# Altium schematic sheet led2.SchDoc
size A4; DocumentNumber: 2; SheetNumber: 2; SheetTotal: 8
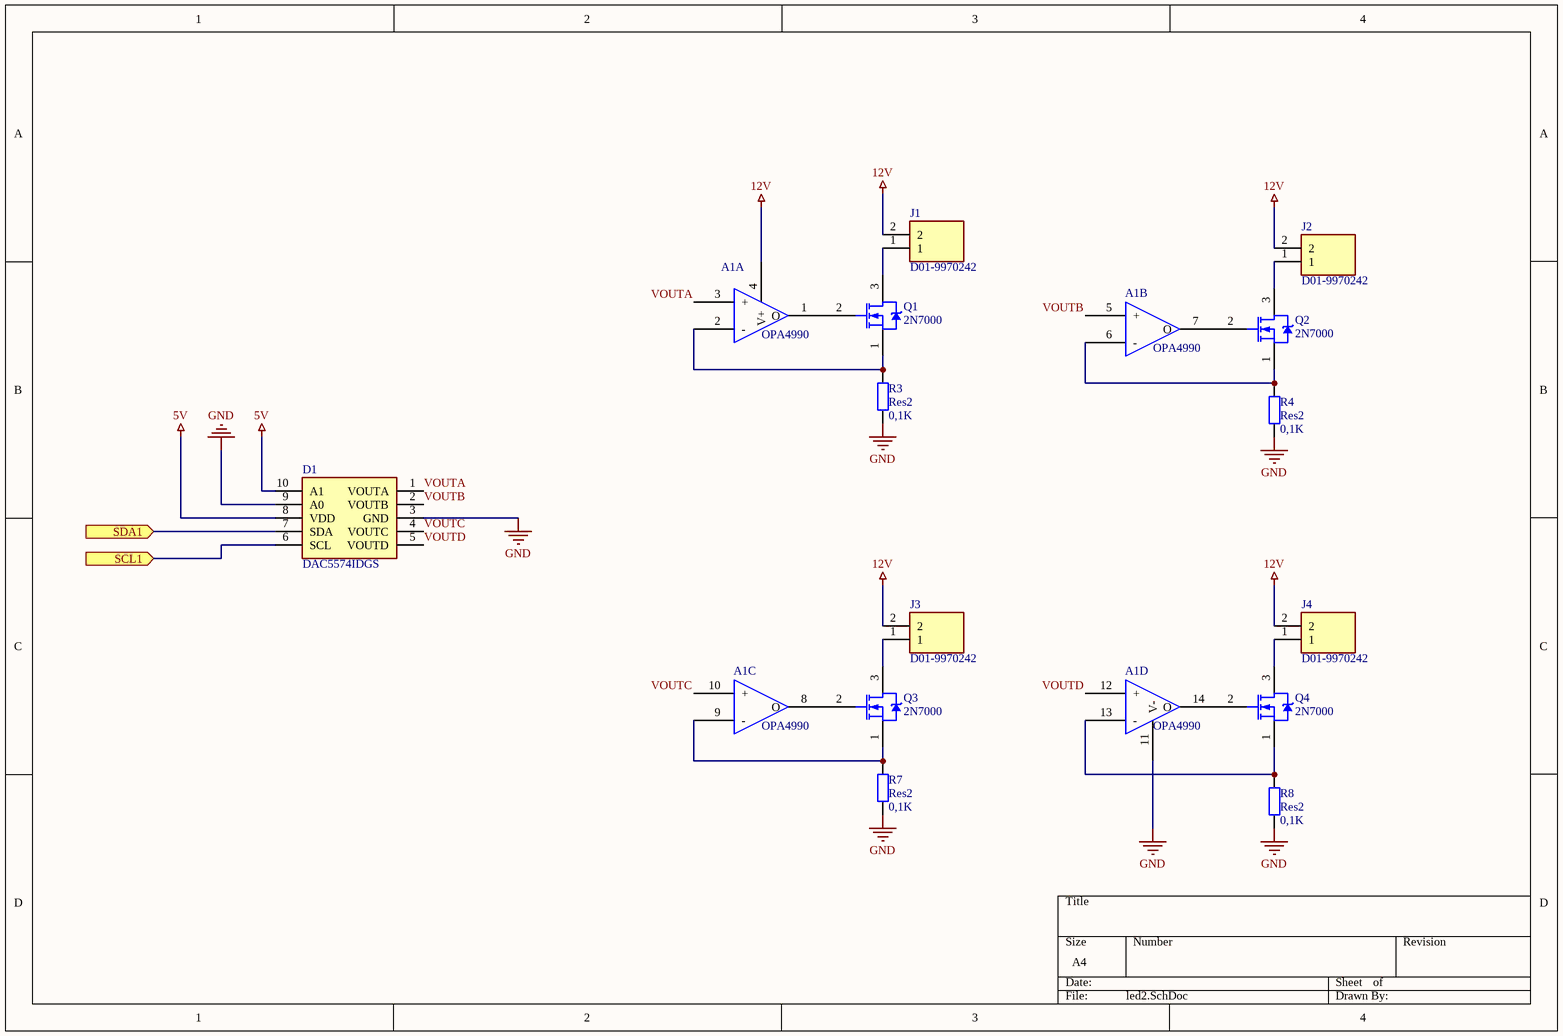
[diagram p0: led2.SchDoc]

## Parts
A1  OPA4990  [SOIC127P600X175-14N]  (parts A,B,C,D of 4)
D1  DAC5574IDGS  [SOP50P490X110-10N]
J1  D01-9970242  [HDR1X2]
J2  D01-9970242  [HDR1X2]
J3  D01-9970242  [HDR1X2]
J4  D01-9970242  [HDR1X2]
Q1  2N7000  [ONSC-TO-92-3-29-11]
Q2  2N7000  [ONSC-TO-92-3-29-11]
Q3  2N7000  [ONSC-TO-92-3-29-11]
Q4  2N7000  [ONSC-TO-92-3-29-11]
R3  Res2  value 0,1K  [C1210]
R4  Res2  value 0,1K  [C1210]
R7  Res2  value 0,1K  [C1210]
R8  Res2  value 0,1K  [C1210]

## Ports
SCL1 (in), SDA1 (in)

## Nets
5V: D1.8(VDD) D1.10(A1)
12V: A1.4(V+) J1.2 J2.2 J3.2 J4.2
GND: A1.11(V-) D1.3(GND) D1.9(A0) R3.1 R4.1 R7.1 R8.1
SCL1: D1.6(SCL) ; port SCL1
SDA1: D1.7(SDA) ; port SDA1
VOUTA: A1.3(+) D1.1(VOUTA)
VOUTB: A1.5(+) D1.2(VOUTB)
VOUTC: A1.10(+) D1.4(VOUTC)
VOUTD: A1.12(+) D1.5(VOUTD)
NetA1_1: A1.1(O) Q1.2(G)
NetA1_2: A1.2(-) Q1.1(S) R3.2
NetA1_6: A1.6(-) Q2.1(S) R4.2
NetA1_7: A1.7(O) Q2.2(G)
NetA1_8: A1.8(O) Q3.2(G)
NetA1_9: A1.9(-) Q3.1(S) R7.2
NetA1_13: A1.13(-) Q4.1(S) R8.2
NetA1_14: A1.14(O) Q4.2(G)
NetJ1_1: J1.1 Q1.3(D)
NetJ2_1: J2.1 Q2.3(D)
NetJ3_1: J3.1 Q3.3(D)
NetJ4_1: J4.1 Q4.3(D)

## Library data of the parts
D1 = DAC5574IDGS: Integrated Circuit; Manufacturer_Name: Texas Instruments; Datasheet Link: http://www.ti.com/lit/gpn/dac5574; Height: 1.1mm; Manufacturer_Part_Number: DAC5574IDGS; Mouser Part Number: 595-DAC5574IDGS; Mouser Price/Stock: https://www.mouser.com/Search/Refine.aspx?Keyword=595-DAC5574IDGS; RS Part Number: 6621533P; RS Price/Stock: http://uk.rs-online.com/web/p/products/6621533P
J1-J4 = D01-9970242: Connector; Manufacturer_Name: HARWIN; Datasheet Link: https://componentsearchengine.com/Datasheets/1/D01-9970242.pdf; Height: 4.25mm; Manufacturer_Part_Number: D01-9970242; Mouser Part Number: 855-D01-9970242; Mouser Price/Stock: https://www.mouser.com/Search/Refine.aspx?Keyword=855-D01-9970242
Q1-Q4 = CMP-1058-00936-1: Small Signal MOSFET, 200 mA, 60 V, N-Channel, 3-Pin TO-92, Bulk Box; Manufacturer: On Semiconductor; Ciss Typ (pF): 60; VGS(th) Max (V): 3; Crss Typ (pF): 5; Channel Polarity: N Channel; VGS Max (V): 20; Configuration: Single; PD Max (W): 0.35; Coss Typ (pF): 25; ID Max (A): 0.2; PackageVersion: Rev. AM; ComponentLink3URL: http://www.onsemi.cn/pub_link/Collateral/2N6426-D.PDF; ComponentLink2URL: http://www.onsemi.com/pub_link/Collateral/2N7000-D.PDF; DatasheetVersion: Rev. 8; Mounting Technology: Through Hole; V(BR)DSS Min (V): 60; PartNumber: 2N7000; PackageDescription: 3-Pin Transistor Outline, Body 4.825 x 3.685 mm, Pitch 1.27 mm; ComponentLink2Description: Datasheet; ComponentLink1URL: http://www.onsemi.com/; PackageReference: TO-92-3-29-11_AM_SL; Packing: Bulk Box; ComponentLink1Description: Manufacturer URL; Package Type: TO-92; ComponentLink3Description: Package Specification
R3 R4 R7 R8 = Res2: Resistor; Published: 8-Jun-2000; LatestRevisionDate: 17-Jul-2002; LatestRevisionNote: Re-released for DXP Platform.; PackageReference: AXIAL-0.4; Publisher: Altium Limited; PackageDescription: Axial Device, Thru-Hole; 2 Leads; 0.4 in Pin Spacing